# Altium schematic sheet CAN.SchDoc
size A4
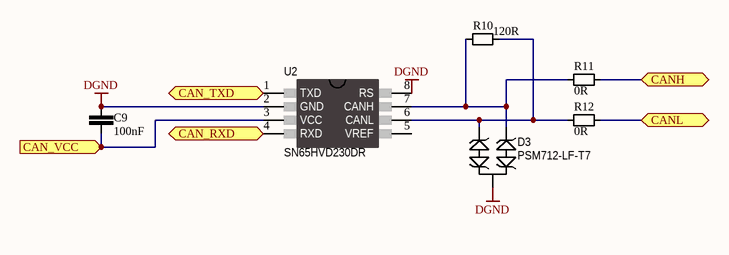
[diagram p0: CAN.SchDoc]

## Parts
C9  value 100nF  [0603-C]  (hidden comment: Cap)
D3  PSM712-LF-T7  [SOT-23_N]
R10  value 120R  [0603-R]  (hidden comment: Res)
R11  value 0R  [0603-R]  (hidden comment: Res)
R12  value 0R  [0603-R]  (hidden comment: Res)
U2  SN65HVD230DR  [SO-8_N]

## Ports
CAN_RXD (out), CAN_TXD (in), CAN_VCC (in), CANH (bidir), CANL (bidir)

## Nets
DGND: C9.2 D3.3 U2.2(GND) U2.8(RS)
CAN_RXD: U2.4(RXD) ; port CAN_RXD
CAN_TXD: U2.1(TXD) ; port CAN_TXD
CAN_VCC: C9.1 U2.3(VCC) ; port CAN_VCC
CANH: R11.2 ; port CANH
CANL: R12.2 ; port CANL
NetD3_1: D3.1 R10.1 R11.1 U2.7(CANH)
NetD3_2: D3.2 R10.2 R12.1 U2.6(CANL)

Not connected (* = marked no-connect by the designer): U2 5(VREF)

## Library data of the parts
C9 = C21C100NK1H0: MLCC 100nF 10% 50V X7R 0603; TemperatureRange: -55°C to 150°C; VenderID: MLCC-0603-50V-104K-X7R; Published: 1-Jun-2017; Publisher: GreenBox; MountType: SMT; PackageReference: 0603; Manufacturer: *
D3 = DT42PSM712LK: TVS PSM712-LF-T7 Vbr 7.5V, 13.3V Vc/Ipp 17V/34A, 30V/30A (3-1 3-2, 1-3 2-3); Manufacturer: PROTEK DEVICES; TemperatureRange: -55°C to 150°C; MountType: SMT; PackageReference: SOT-23; Published: 1-Jun-2017; Publisher: GreenBox; VenderID: PSM712-LF-T7
R10 = R11C120RFBF0: SMD Resistor 120R 1% 1/10W 0603 100PPM; TemperatureRange: -55°C to 150°C; VenderID: RES-0603-120R-1%; Published: 1-Jun-2017; Publisher: GreenBox; MountType: SMT; PackageReference: 0603; Manufacturer: *
R11 R12 = R11C000RFBF0: SMD Resistor 0R 1% 1/10W 0603 100PPM; TemperatureRange: -55°C to 150°C; VenderID: RES-0603-0R-1%; Published: 1-Jun-2017; Publisher: GreenBox; MountType: SMT; PackageReference: 0603; Manufacturer: *
U2 = U2S1VD230DRT: CAN Bus Transceivers SN65HVD230DR Vcc 3.3V; Manufacturer: TEXAS INSTRUMENTS; TemperatureRange: -40 to 85°C; MountType: SMT; PackageReference: SOIC-8; Published: 1-Jun-2017; Publisher: GreenBox; VenderID: SN65HVD230DR